# Altium project Xedieukhien.PrjPcb
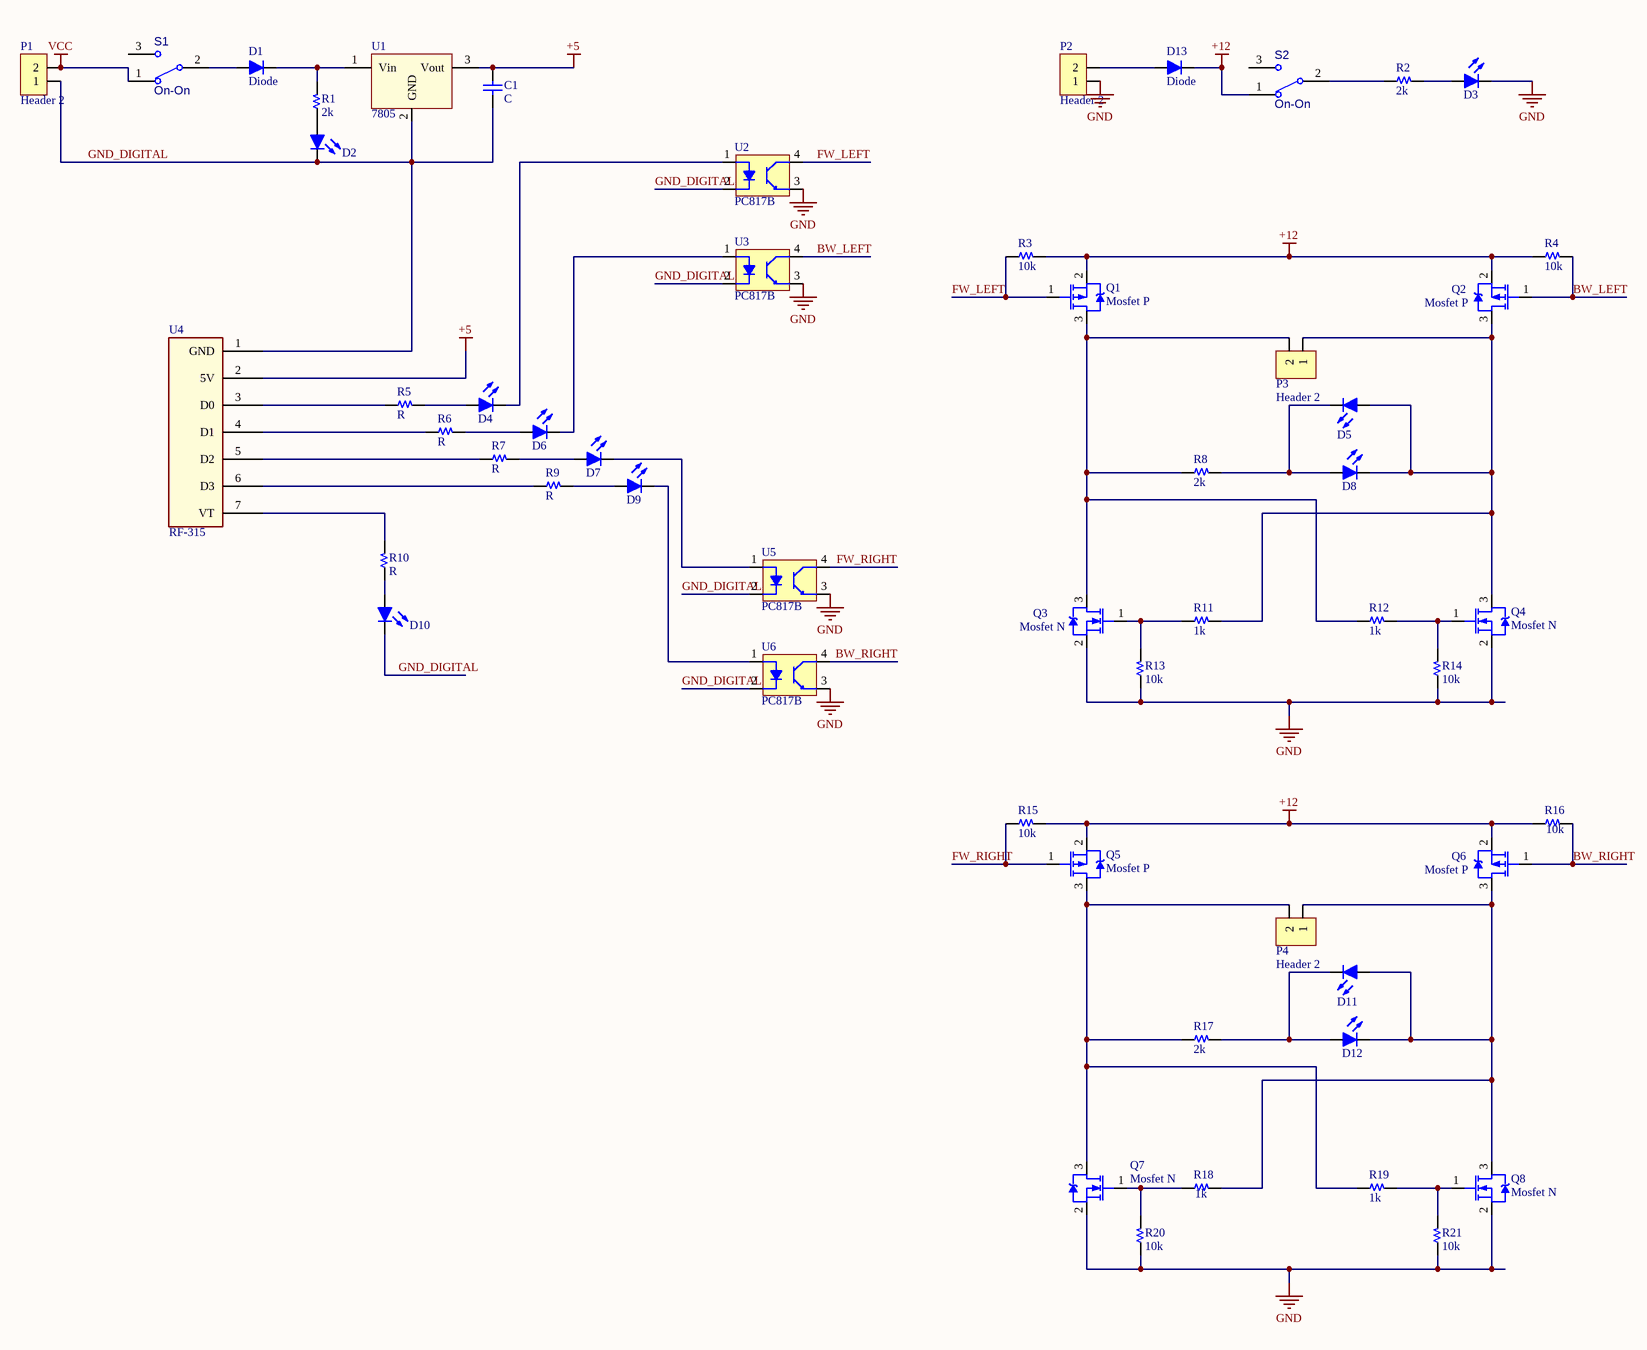
[diagram p0: Xedk.SchDoc]
1 sheet, 55 parts. Net scope: global (net labels, ports and power ports of the same name join across sheets).
Board file: Xedk.PcbDoc

## Sheet Xedk.SchDoc
size A1; SheetNumber: 1; SheetTotal: 1

### Parts
C1  C  [CAP Ceramic/W300]
D1  Diode  [DO-41]
D2  Led  [LED 5MM - GREEN]  (value not drawn)
D3  Led  [LED 5MM - GREEN]  (value not drawn)
D4  Led  [LED 5MM - RED]  (value not drawn)
D5  Led  [LED 5MM - RED]  (value not drawn)
D6  Led  [LED 5MM - RED]  (value not drawn)
D7  Led  [LED 5MM - RED]  (value not drawn)
D8  Led  [LED 5MM - GREEN]  (value not drawn)
D9  Led  [LED 5MM - RED]  (value not drawn)
D10  Led  [LED 5MM - RED]  (value not drawn)
D11  Led  [LED 5MM - RED]  (value not drawn)
D12  Led  [LED 5MM - GREEN]  (value not drawn)
D13  Diode  [DO-41]
P1  Header 2  [HDR/Terminal/2/5mm]
P2  Header 2  [HDR/Terminal/2/5mm]
P3  Header 2  [HDR/Terminal/2/5mm]
P4  Header 2  [HDR/Terminal/2/5mm]
Q1  Mosfet P  [TO-220]
Q2  Mosfet P  [TO-220]
Q3  Mosfet N  [TO-220]
Q4  Mosfet N  [TO-220]
Q5  Mosfet P  [TO-220]
Q6  Mosfet P  [TO-220]
Q7  Mosfet N  [TO-220]
Q8  Mosfet N  [TO-220]
R1  2k  [R 1/4W/300]
R2  2k  [R 1/4W/300]
R3  10k  [R 1/4W/300]
R4  10k  [R 1/4W/300]
R5  R  [R 1/4W/300]
R6  R  [R 1/4W/300]
R7  R  [R 1/4W/300]
R8  2k  [R 1/4W/300]
R9  R  [R 1/4W/300]
R10  R  [R 1/4W/300]
R11  1k  [R 1/4W/300]
R12  1k  [R 1/4W/300]
R13  10k  [R 1/4W/300]
R14  10k  [R 1/4W/300]
R15  10k  [R 1/4W/300]
R16  10k  [R 1/4W/300]
R17  2k  [R 1/4W/300]
R18  1k  [R 1/4W/300]
R19  1k  [R 1/4W/300]
R20  10k  [R 1/4W/300]
R21  10k  [R 1/4W/300]
S1  ON-ON  [SWITCH_SPDT_SLIDER]
S2  ON-ON  [SWITCH_SPDT_SLIDER]
U1  7805  [TO-220]
U2  PC817B  [DIP 4]
U3  PC817B  [DIP 4]
U4  RF-315  [RF-315 7 pins]
U5  PC817B  [DIP 4]
U6  PC817B  [DIP 4]

### Nets
+5: C1.1 U1.3(Vout) U4.2(5V)
+12: D13.2(K) Q1.2(S) Q2.2(S) Q5.2(S) Q6.2(S) R3.2 R4.1 R15.2 R16.1 S2.1
GND: D3.2(K) P2.1 Q3.2(S) Q4.2(S) Q7.2(S) Q8.2(S) R13.1 R14.1 R20.1 R21.1 U2.3(E) U3.3(E) U5.3(E) U6.3(E)
VCC: P1.2 S1.1
BW_LEFT: Q2.1(G) R4.2 U3.4(C)
BW_RIGHT: Q6.1(G) R16.2 U6.4(C)
FW_LEFT: Q1.1(G) R3.1 U2.4(C)
FW_RIGHT: Q5.1(G) R15.1 U5.4(C)
GND_DIGITAL: C1.2 D2.2(K) D10.2(K) P1.1 U1.2(GND) U2.2(K) U3.2(K) U4.1(GND) U5.2(K) U6.2(K)
NetD1_1: D1.1(A) S1.2
NetD1_2: D1.2(K) R1.2 U1.1(Vin)
NetD2_1: D2.1(A) R1.1
NetD3_1: D3.1(A) R2.2
NetD4_1: D4.1(A) R5.2
NetD4_2: D4.2(K) U2.1(A)
NetD5_1: D5.1(A) D8.2(K) P3.1 Q2.3(D) Q4.3(D) R11.2
NetD5_2: D5.2(K) D8.1(A) R8.2
NetD6_1: D6.1(A) R6.2
NetD6_2: D6.2(K) U3.1(A)
NetD7_1: D7.1(A) R7.2
NetD7_2: D7.2(K) U5.1(A)
NetD9_1: D9.1(A) R9.2
NetD9_2: D9.2(K) U6.1(A)
NetD10_1: D10.1(A) R10.1
NetD11_1: D11.1(A) D12.2(K) P4.1 Q6.3(D) Q8.3(D) R18.2
NetD11_2: D11.2(K) D12.1(A) R17.2
NetD13_1: D13.1(A) P2.2
NetP3_2: P3.2 Q1.3(D) Q3.3(D) R8.1 R12.1
NetP4_2: P4.2 Q5.3(D) Q7.3(D) R17.1 R19.1
NetQ3_1: Q3.1(G) R11.1 R13.2
NetQ4_1: Q4.1(G) R12.2 R14.2
NetQ7_1: Q7.1(G) R18.1 R20.2
NetQ8_1: Q8.1(G) R19.2 R21.2
NetR2_1: R2.1 S2.2
NetR5_1: R5.1 U4.3(D0)
NetR6_1: R6.1 U4.4(D1)
NetR7_1: R7.1 U4.5(D2)
NetR9_1: R9.1 U4.6(D3)
NetR10_2: R10.2 U4.7(VT)

Not connected (* = marked no-connect by the designer): S1 3; S2 3

### Library data of the parts
C1 = Capacitor NP: Capacitor non-pol
D1 D13 = Diode: Default Diode
D2-D12 = Led: Typical LED
P1-P4 = Header 2: Header, 2-Pin
Q1 Q2 Q5 Q6 = Mosfet P: pin to pad: 2>3 3>2
Q3 Q4 Q7 Q8 = Mosfet N: pin to pad: 2>3 3>2
R1-R21 = Resistor
S1 S2 = SW_THD_SPDT_On-On: Switch THD vertical toggle SPDT; Manufacturer 1: TE Connectivity; Manufacturer Part Number 1: SLS121PC04; Contact Rating @ Voltage: 0.25A @ 125VAC; SCDType: spec; Circuit: SPDT; Mounting Type: PCB mount; Supplier 1: Digi-Key; Supplier Part Number 1: 450-1598-ND; Switch Function: On-On
U1 = 78xx: LDO Fixed Voltage regulator
U2 U3 U5 U6 = Opto PC817B